# Altium project AudioBoxDMX.PrjPcb
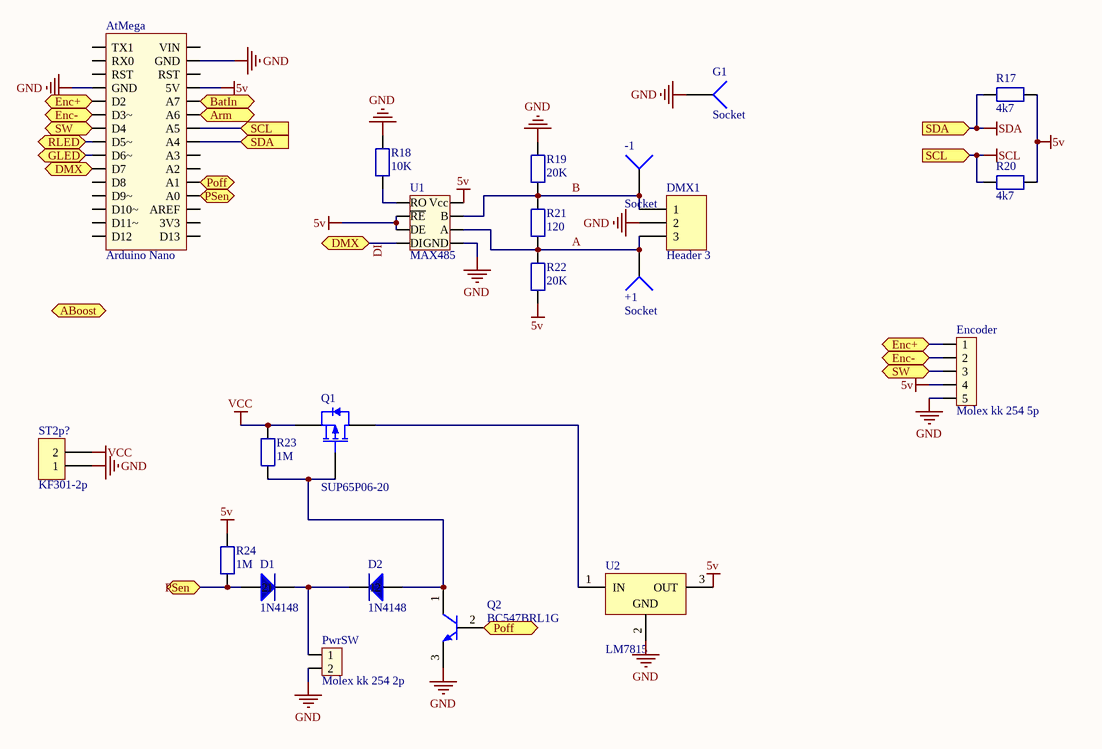
[diagram p0: Main.SchDoc]
2 sheets, 63 parts. Net scope: flat (ports and power ports of the same name join across sheets).
Board file: PCB.PcbDoc
Sheets:
  Main.SchDoc
  INA219Input.SchDoc

## Sheet Main.SchDoc
size A4

### Parts
+1  Socket  [PIN1]
-1  Socket  [PIN1]
AtMega  Arduino Nano  [Arduino Nano]
D1  1N4148  [1N4148-AX0.2"]
D2  1N4148  [1N4148-AX0.2"]
DMX1  Header 3  [HDR1X3]
Encoder  Molex kk 254 5p  [Molex kk 254 5p]
G1  Socket  [PIN1]
PwrSW  Molex kk 254 2p  [Molex kk 254 2p]
Q1  SUP65P06-20  [TO-220AB]
Q2  BC547BRL1G  [ONSC-TO-92-3-29-11_AM_BL]
R17  4k7  [Axial 0.3" 1/4W]
R18  10K  [Axial 0.3" 1/4W]
R19  20K  [Axial 0.3" 1/4W]
R20  4k7  [Axial 0.3" 1/4W]
R21  120  [Axial 0.3" 1/4W]
R22  20K  [Axial 0.3" 1/4W]
R23  1M  [Axial 0.3" 1/4W]
R24  1M  [Axial 0.3" 1/4W]
ST2p?  KF301-2p  [KF301-2p_0.2"]
U1  MAX485  [DIP8]
U2  LM7815  [221A-04]

### Ports
ABoost, Arm, BatIn, DMX, Enc+, Enc-, GLED, Poff, PSen, RLED, SCL, SDA, SW

### Nets
5v: AtMega.27(5V) Encoder.4 R17.2 R20.2 R22.1 R24.2 U1.2(~{RE}) U1.3(DE) U1.8(Vcc) U2.3(OUT)
GND: AtMega.4(GND) AtMega.29(GND) DMX1.2 Encoder.5 G1.1 PwrSW.2 Q2.3(E) R18.1 R19.2 ST2p?.1 U1.5(GND) U2.2(GND)
SCL: AtMega.24(A5) R20.1 ; port SCL
SDA: AtMega.23(A4) R17.1 ; port SDA
VCC: Q1.3(S) R23.2 ST2p?.2
A: +1.1 DMX1.3 R21.1 R22.2 U1.6(A)
B: -1.1 DMX1.1 R19.1 R21.2 U1.7(B)
DI: AtMega.10(D7) U1.4(DI) ; port DMX
NetAtMega_5: AtMega.5(D2) Encoder.1 ; port Enc+
NetAtMega_6: AtMega.6(D3~) Encoder.2 ; port Enc-
NetAtMega_7: AtMega.7(D4) Encoder.3 ; port SW
NetAtMega_8: AtMega.8(D5~) ; port RLED
NetAtMega_9: AtMega.9(D6~) ; port GLED
NetAtMega_19: AtMega.19(A0) D1.1 R24.1 ; port PSen
NetAtMega_20: AtMega.20(A1) Q2.2(B) ; port Poff
NetAtMega_25: AtMega.25(A6) ; port Arm
NetAtMega_26: AtMega.26(A7) ; port BatIn
NetD1_2: D1.2 D2.2 PwrSW.1
NetD2_1: D2.1 Q1.1(G) Q2.1(C) R23.1
NetQ1_2: Q1.2(D) U2.1(IN)
NetR18_2: R18.2 U1.1(RO)

Not connected (* = marked no-connect by the designer): AtMega 1(TX1) 2(RX0) 3(RST) 11(D8) 12(D9~) 13(D10~) 14(D11~) 15(D12) 16(D13) 17(3V3) 18(AREF) 21(A2) 22(A3) 28(RST) 30(VIN)

### Library data of the parts
DMX1 = Header 3: Header, 3-Pin; LatestRevisionDate: 17-Jul-2002; LatestRevisionNote: Re-released for DXP Platform.; Publisher: Altium Limited
Q1 = SUP65P06-20: P-Channel 60V (D-S), 175'C  MOSFET; Note: Pin 2 (Drain) is connected to TAB; Published: 8-Jun-2000; LatestRevisionDate: 17-Jul-2002; LatestRevisionNote: Re-released for DXP Platform.; DatasheetVersion: 24-Feb-1998; PackageReference: TO-220AB; Publisher: Altium Limited; PackageDescription: TO, Thru-Hole, Vertical, Heatsink Mounted; 3 In-Line Leads; Pitch 2.54 mm; Code_JEDEC: TO-220-AB-alt; ComponentLink1Description: Manufacturer Link; ComponentLink1URL: http://www.vishay.com/; ComponentLink2Description: Datasheet; ComponentLink2URL: http://www.vishay.com/docs/70289/70289.pdf
Q2 = BC547BRL1G: Amplifier Transistor, NPN Silicon, 3-Pin TO-92, Pb-Free, Tape and Reel; Manufacturer: On Semiconductor; fT Min (MHz): 150; IC Continuous (A): 0.1; DatasheetVersion: Rev. 7; PackageVersion: Rev. AM; PackageReference: TO-92-3-29-11_AM_BL; PackageDescription: 3-Pin Transistor Outline, Body 4.825 x 3.685 mm, Pitch 1.27 mm; Supplier 1: Digi-Key; Supplier Part Number 1: BC547BRL1GOSTR-ND; Supplier 2: Digi-Key; Supplier Part Number 2: BC547BRL1GOSCT-ND; Supplier 3: Farnell; Supplier Part Number 3: 2317853; Supplier 4: Farnell; Supplier Part Number 4: 2317547; Supplier 5: Newark; Supplier Part Number 5: 26K3431; Supplier 6: Mouser; Supplier Part Number 6: 863-BC547BRL1G; Packing: Tape and Reel; Polarity: NPN; RoHS: TRUE; Mounting Technology: Through Hole; PartNumber: BC547BRL1G; ComponentLink1Description: Manufacturer URL; ComponentLink1URL: http://www.onsemi.com/; ComponentLink2Description: Datasheet; ComponentLink2URL: http://www.onsemi.com/pub_link/Collateral/BC546-D.PDF; ComponentLink3Description: Package Specification; ComponentLink3URL: http://www.onsemi.com/pub_link/Collateral/MAC97-D.PDF
R17-R24 = Axial 0.3" 1/4W
ST2p? = KF301-2p_0.2": Screw terminal KF301-2p 0.2" pitch 5.08mm
U1 = MAX845 DIP8
U2 = LM7815: 3-Terminal Positive Fixed Voltage Regulator; Note: Heatsink surface connected to pin 2.; Published: 17-Jul-2002; DatasheetVersion: 1988; PackageReference: 221A-04; Publisher: Altium Limited; PackageDescription: TO, Thru-Hole, Vertical, Heatsink Mounted; 3 In-Line Leads; Pitch 2.54 mm; Code_JEDEC: TO-262-AA; ComponentLink1Description: Manufacturer Link; ComponentLink1URL: http://www.onsemi.com/site/products/taxonomy/0,4438,503,00.html
+1 -1 G1 = Socket: LatestRevisionDate: 17-Jul-2002; LatestRevisionNote: Re-released for DXP Platform.; Publisher: Altium Limited

## Sheet INA219Input.SchDoc
size A4
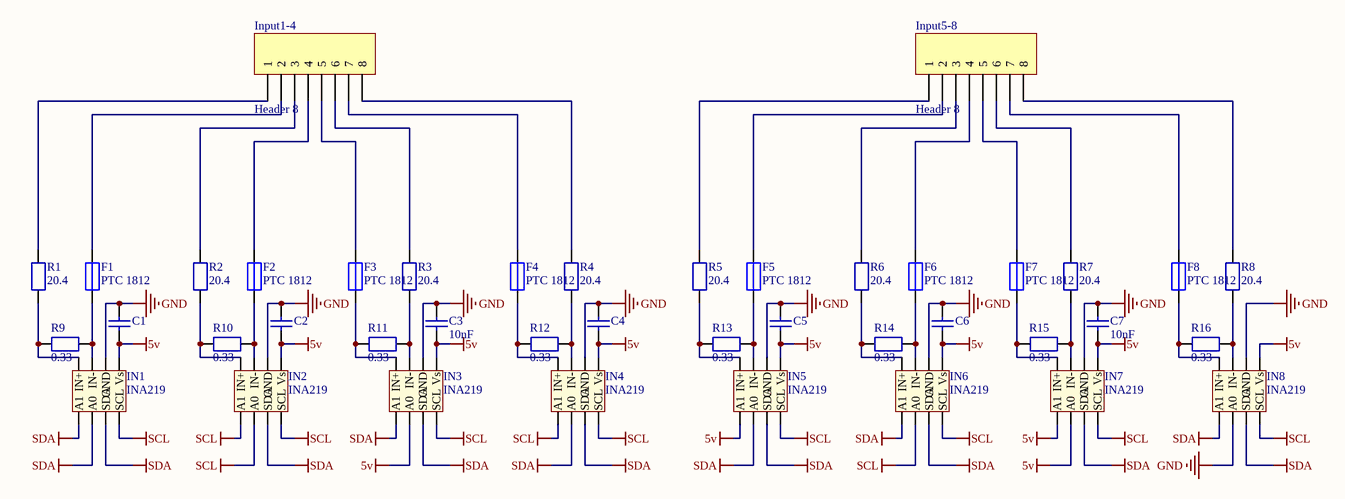
[diagram p1: INA219Input.SchDoc]

### Parts
C1  (no value)  [1" ceramic Radial Cap]
C2  (no value)  [1" ceramic Radial Cap]
C3  10nF  [1" ceramic Radial Cap]
C4  (no value)  [1" ceramic Radial Cap]
C5  (no value)  [1" ceramic Radial Cap]
C6  (no value)  [1" ceramic Radial Cap]
C7  10nF  [1" ceramic Radial Cap]
F1  PTC 1812  [0ZCG PTC 1812]
F2  PTC 1812  [0ZCG PTC 1812]
F3  PTC 1812  [0ZCG PTC 1812]
F4  PTC 1812  [0ZCG PTC 1812]
F5  PTC 1812  [0ZCG PTC 1812]
F6  PTC 1812  [0ZCG PTC 1812]
F7  PTC 1812  [0ZCG PTC 1812]
F8  PTC 1812  [0ZCG PTC 1812]
IN1  INA219  [INA219-D-SOIC]
IN2  INA219  [INA219-D-SOIC]
IN3  INA219  [INA219-D-SOIC]
IN4  INA219  [INA219-D-SOIC]
IN5  INA219  [INA219-D-SOIC]
IN6  INA219  [INA219-D-SOIC]
IN7  INA219  [INA219-D-SOIC]
IN8  INA219  [INA219-D-SOIC]
Input1-4  Header 8  [HDR1X8]
Input5-8  Header 8  [HDR1X8]
R1  20.4  [Axial 0.85 5W]
R2  20.4  [Axial 0.85 5W]
R3  20.4  [Axial 0.85 5W]
R4  20.4  [Axial 0.85 5W]
R5  20.4  [Axial 0.85 5W]
R6  20.4  [Axial 0.85 5W]
R7  20.4  [Axial 0.85 5W]
R8  20.4  [Axial 0.85 5W]
R9  0.33  [1206 SMD 1/4W]
R10  0.33  [1206 SMD 1/4W]
R11  0.33  [1206 SMD 1/4W]
R12  0.33  [1206 SMD 1/4W]
R13  0.33  [1206 SMD 1/4W]
R14  0.33  [1206 SMD 1/4W]
R15  0.33  [1206 SMD 1/4W]
R16  0.33  [1206 SMD 1/4W]

### Nets
5v: C1.1 C2.1 C3.1 C4.1 C5.1 C6.1 C7.1 IN1.Vs IN2.Vs IN3.A0 IN3.Vs IN4.Vs IN5.A1 IN5.Vs IN6.Vs IN7.A0 IN7.A1 IN7.Vs IN8.Vs
GND: C1.2 C2.2 C3.2 C4.2 C5.2 C6.2 C7.2 IN1.GND IN2.GND IN3.GND IN4.GND IN5.GND IN6.GND IN7.GND IN8.A0 IN8.GND
SCL: IN1.SCL IN2.A0 IN2.A1 IN2.SCL IN3.SCL IN4.A1 IN4.SCL IN5.SCL IN6.A0 IN6.SCL IN7.SCL IN8.SCL
SDA: IN1.A0 IN1.A1 IN1.SDA IN2.SDA IN3.A1 IN3.SDA IN4.A0 IN4.SDA IN5.A0 IN5.SDA IN6.A1 IN6.SDA IN7.SDA IN8.A1 IN8.SDA
NetF1_1: F1.1 IN1.IN- R9.1
NetF1_2: F1.2 Input1-4.2
NetF2_1: F2.1 IN2.IN- R10.1
NetF2_2: F2.2 Input1-4.4
NetF3_1: F3.1 IN3.IN+ R11.2
NetF3_2: F3.2 Input1-4.5
NetF4_1: F4.1 IN4.IN+ R12.2
NetF4_2: F4.2 Input1-4.7
NetF5_1: F5.1 IN5.IN- R13.1
NetF5_2: F5.2 Input5-8.2
NetF6_1: F6.1 IN6.IN- R14.1
NetF6_2: F6.2 Input5-8.4
NetF7_1: F7.1 IN7.IN+ R15.2
NetF7_2: F7.2 Input5-8.5
NetF8_1: F8.1 IN8.IN+ R16.2
NetF8_2: F8.2 Input5-8.7
NetIN1_IN+: IN1.IN+ R1.1 R9.2
NetIN2_IN+: IN2.IN+ R2.1 R10.2
NetIN3_IN-: IN3.IN- R3.1 R11.1
NetIN4_IN-: IN4.IN- R4.1 R12.1
NetIN5_IN+: IN5.IN+ R5.1 R13.2
NetIN6_IN+: IN6.IN+ R6.1 R14.2
NetIN7_IN-: IN7.IN- R7.1 R15.1
NetIN8_IN-: IN8.IN- R8.1 R16.1
NetInput1-4_1: Input1-4.1 R1.2
NetInput1-4_3: Input1-4.3 R2.2
NetInput1-4_6: Input1-4.6 R3.2
NetInput1-4_8: Input1-4.8 R4.2
NetInput5-8_1: Input5-8.1 R5.2
NetInput5-8_3: Input5-8.3 R6.2
NetInput5-8_6: Input5-8.6 R7.2
NetInput5-8_8: Input5-8.8 R8.2

### Library data of the parts
C1-C7 = 1" ceramic Radial Cap
F1-F8 = PTC 1812 Bel Fuse
IN1-IN8 = INA219-D-SOIC
Input1-4 Input5-8 = Header 8: Header, 8-Pin; LatestRevisionDate: 17-Jul-2002; LatestRevisionNote: Re-released for DXP Platform.; Publisher: Altium Limited
R1-R8 = Axial 0.85" 5W
R9-R16 = 1206 SMD 1/4W

## Nets that join several sheets
5v: Main (10 pins), INA219Input (19 pins)
GND: Main (12 pins), INA219Input (16 pins)
SCL: Main (AtMega.24 R20.1), INA219Input (12 pins)
SDA: Main (AtMega.23 R17.1), INA219Input (15 pins)